# EAGLE design Adafruit ISO1540 (EAGLE 9.6.2)
AUTHOR: BRYAN; COMPANY: ADAFRUIT INDUSTRIES; REV: A
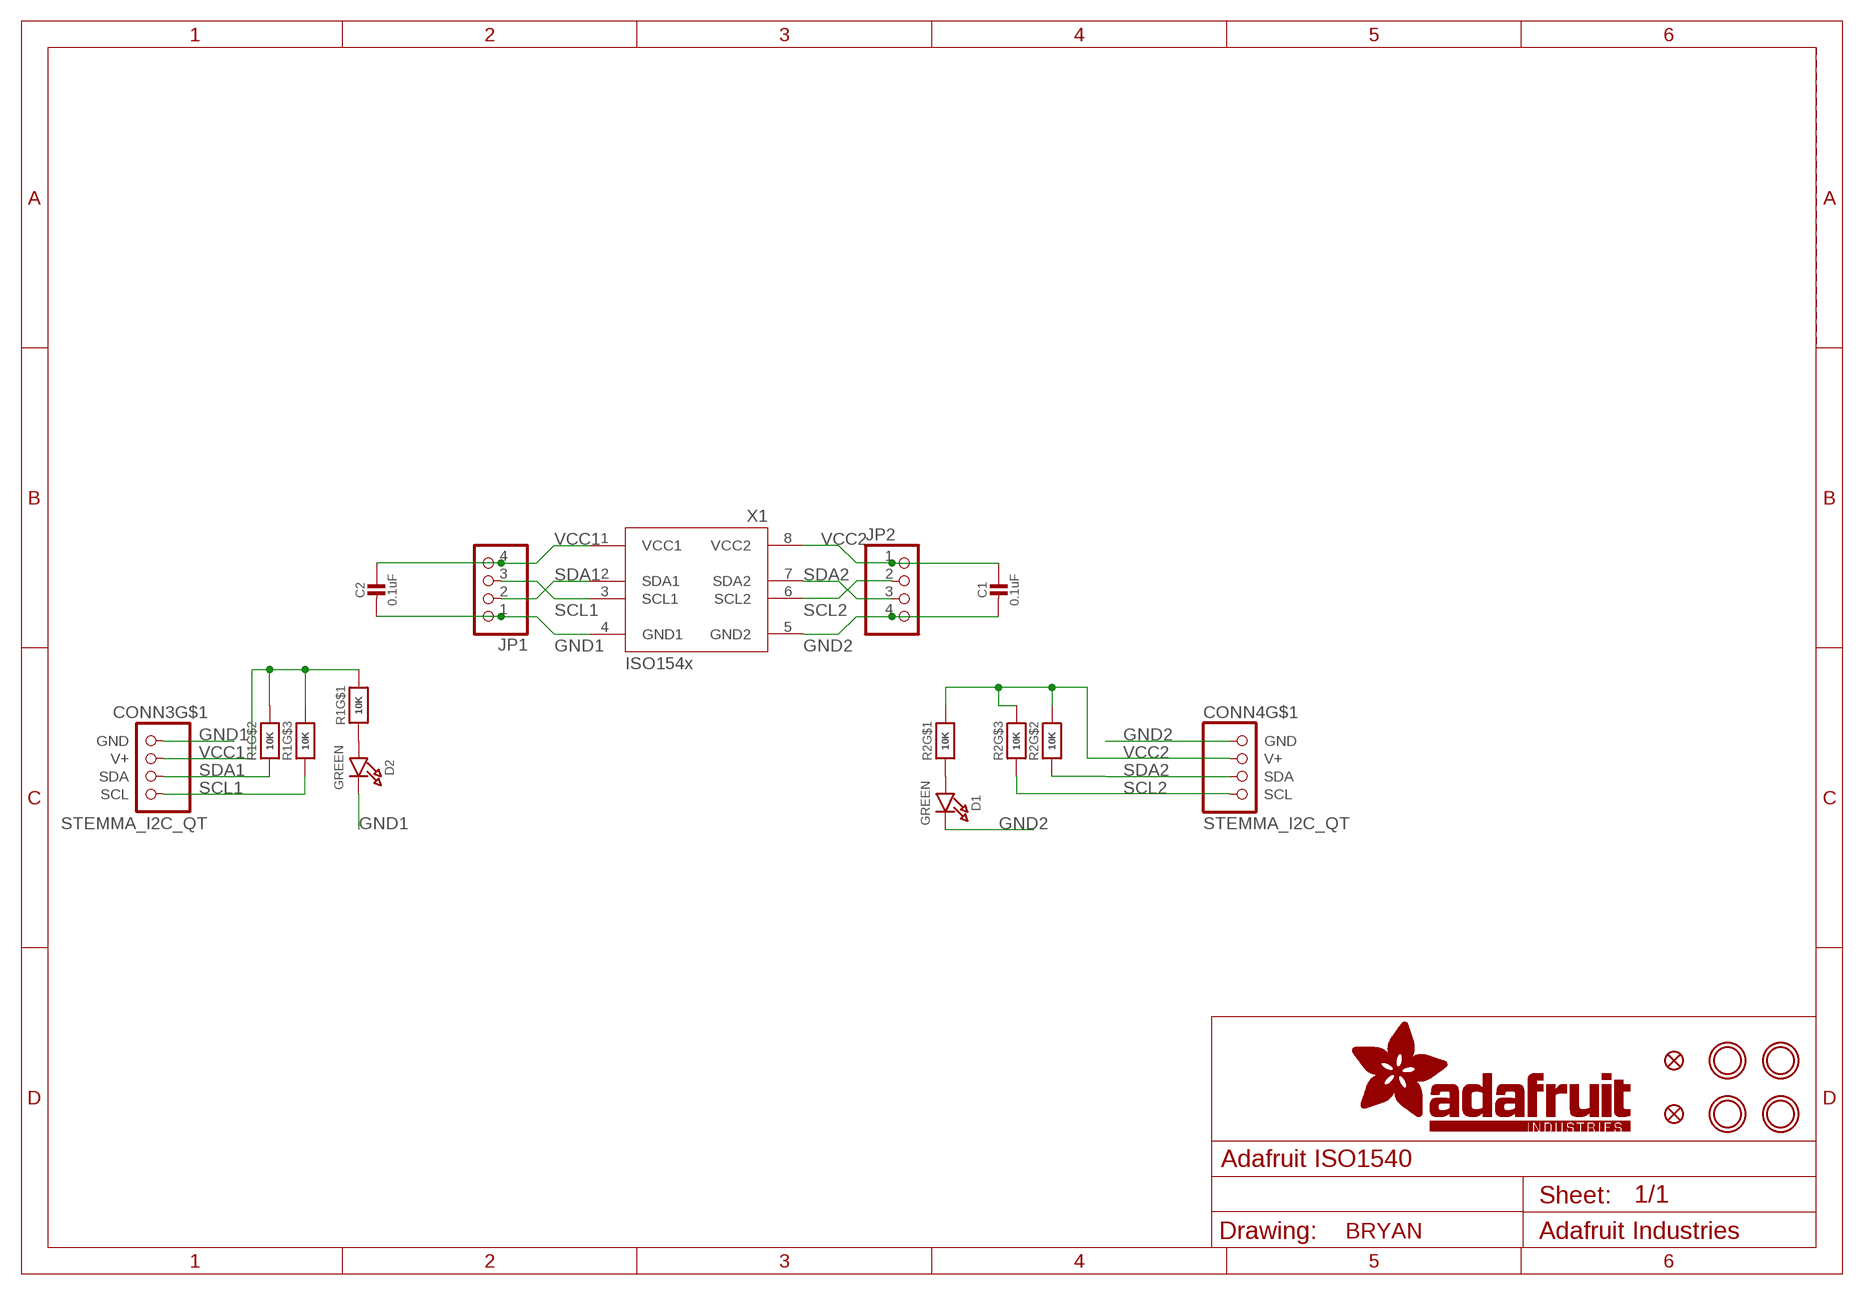
[diagram p0: schematic, sheet 1]

## Parts
C1  0.1uF  CAP_CERAMIC0603_NO  [0603-NO]
C2  0.1uF  CAP_CERAMIC0603_NO  [0603-NO]
CONN3  STEMMA_I2C_QT  [JST_SH4]
CONN4  STEMMA_I2C_QT  [JST_SH4]
D1  GREEN  LED0603_NOOUTLINE  [CHIPLED_0603_NOOUTLINE]
D2  GREEN  LED0603_NOOUTLINE  [CHIPLED_0603_NOOUTLINE]
FID3  FIDUCIAL_1MM  [FIDUCIAL_1MM]
FID4  FIDUCIAL_1MM  [FIDUCIAL_1MM]
JP1  HEADER-1X4ROUND  [1X04_ROUND]
JP2  HEADER-1X4ROUND  [1X04_ROUND]
R1  10K  RESISTOR_4PACK  [RESPACK_4X0603]
R2  10K  RESISTOR_4PACK  [RESPACK_4X0603]
U$1  MOUNTINGHOLE2.5  [MOUNTINGHOLE_2.5_PLATED]
U$17  MOUNTINGHOLE2.5  [MOUNTINGHOLE_2.5_PLATED]
U$19  MOUNTINGHOLE2.5  [MOUNTINGHOLE_2.5_PLATED]
U$21  MOUNTINGHOLE2.5  [MOUNTINGHOLE_2.5_PLATED]
X1  ISO154X  [SOIC8_150MIL]

## Nets
GND1: C2.2 CONN3.1(GND) D2.C JP1.1 X1.4(GND1)
GND2: C1.2 CONN4.1(GND) D1.C JP2.4 X1.5(GND2)
N$1: D2.A R1.1
N$2: D1.A R2.1
SCL1: CONN3.4(SCL) JP1.3 R1.3 X1.3(SCL1)
SCL2: CONN4.4(SCL) JP2.2 R2.3 X1.6(SCL2)
SDA1: CONN3.3(SDA) JP1.2 R1.2 X1.2(SDA1)
SDA2: CONN4.3(SDA) JP2.3 R2.2 X1.7(SDA2)
VCC1: C2.1 CONN3.2(V+) JP1.4 R1.6 R1.7 R1.8 X1.1(VCC1)
VCC2: C1.1 CONN4.2(V+) JP2.1 R2.6 R2.7 R2.8 X1.8(VCC2)
Unconnected: CONN3.MT1(MT) CONN3.MT2(MT) CONN4.MT1(MT) CONN4.MT2(MT) R1.4 R1.5 R2.4 R2.5

## Library data of the parts
C1 C2 = microbuilder:CAP_CERAMIC: Ceramic Capacitors For new designs, use the packages preceded by an '_' character since they are more reliable: The following footprints should be used on most boards: _0402 - Standard footprint for regular board layouts _0603 - Standard footprint for regular board layouts _0805 - Standard footprint for regular board layouts _1206 - Standard footprint for regular board layouts For extremely tight-pitch boards where space is at a premium, the following 'micro-pitch' footprints can be used (smaller pads, no silkscreen outline, etc.): _0402MP - Micro-pitch footprint for very dense/compact boards _0603MP - Micro-pitch footprint for very dense/compact boards _0805MP - Micro-pitch footprint for very dense/compact boards _1206MP - Micro-pitch footprint for very dense/compact boards
CONN3 CONN4 = microbuilder:STEMMA_I2C
D1 D2 = microbuilder:LED: LED 0603 - 0603 Surface Mount Package 2mA: Green LED - Low Power (3.9mcd, 2ma, 1.7Vf) - Digikey: 475-2709-2-ND Orange LED - Low Power (9.8mcd, 2ma, 1.8Vf) - Digikey: 475-1194-2-ND Red LED - Low Power (5mcd, 2ma, 1.8Vf) - Digikey: 475-1195-2-ND Yellow LED - Low Power (7mcd, 2ma, 1.8Vf) - Digikey: 475-1196-2-ND 5mA: Blue LED - Low Power (17mcd, 5ma, 2.9Vf) - Digikey: LNJ937W8CRACT-ND 0805 - 0805 Surface Mount Package 2mA: Red LED (8.8mcd, 2mA, 1.8Vf, Clear) - Low Power [Digikey: 475-2510-1-ND] Green LED (5mcd, 2mA, 1.8Vf, Clear) - Low Power [Digikey: 475-2730-1-ND] Yellow LED (11.3mcd, 2mA, 1.8Vf, Clear) - Low Power [Digikey: 475-2555-1-ND] 20mA: Red LED (104mcd, 20mA, Diffused) - LS R976 [Digikey: 475-1278-6-ND] Red LED (12mcd, 20mA, 2.0Vf, Clear) - APT2012EC [Digikey: 754-1128-1-ND] Green LED (15mcd, 20mA, 2.2Vf, Clear) - APT2012GC [Digikey: 754-1131-1-ND] Orange LED (160mcd, 20mA, 2.1Vf, Clear) - APT2012SECK [Digikey: 754-1130-1-ND] 1206 - 1206 Surface Mount Package Green LED (26mcd, 20mA, Diffused) - LG N971 [Digikey: 475-1407-6-ND] Red LED (15mcd, 20mA, Diffused) - LH N974 [Digikey: 475-1416-6-ND] Cree - Cree High-Power Surface Mount LEDs XPEBWT-L1-0000-00D50 - White 111lm 350mA 2.9Vf 6200K 110° XTEAWT-00-0000-00000LEE3 - White 114lm 350mA 2.85Vf 5000K 115° Everlight - Everlight 45-21 Series Surface Mount LEDs 45-21/QK2C-B2832AC2CB2/2T - Warm White 2000mcd 20mA 3.25Vf 3050K 120° 45-21/LK2C-B38452C4CB2/2T - Nuetral White 2000mcd 20mA 3.25Vf 4150K 120° 45-21/LK2C-B50634C6CB2/2T - Cold White 2200mcd 20mA 3.25Vf 5650K 120° PLCC2 Reverse Mount LS T77K-J1L2-1-0-2-R18-Z - Red 11.25mcd 2mA 1.8Vf 630nm 120° LO T77K-L1M2-24-Z - Orange 19.6mcd 2mA 1.8Vf 606nm 120° LY T77K-K2M1-26-Z - Yellow 15.7mcd 2mA 1.8Vf 587nm 120°
FID3 FID4 = microbuilder:FIDUCIAL: Fiducial Alignment Points Various fiducial points for machine vision alignment.; BOM: EXCLUDE
JP1 JP2 = microbuilder:HEADER-1X4: PIN HEADER
R1 R2 = microbuilder:RESISTOR_4PACK: Resistor Packs (4 resistors) 4 x 0603 10K 1/16W - Digikey: YC164J-10KCT-ND
U$1 U$17 U$19 U$21 = microbuilder:MOUNTINGHOLE: Mounting Hole For #2 screws (0.086"/2.18mm width, 0.094"/2.4mm hole) use 2.5mm; BOM: EXCLUDE
X1 = adafruit_power:ISO154X

## Net classes
1 highpower: width 0.406 mm, drill 0.483 mm
2 lowpower: width 0.305 mm, drill 0.483 mm

## Board
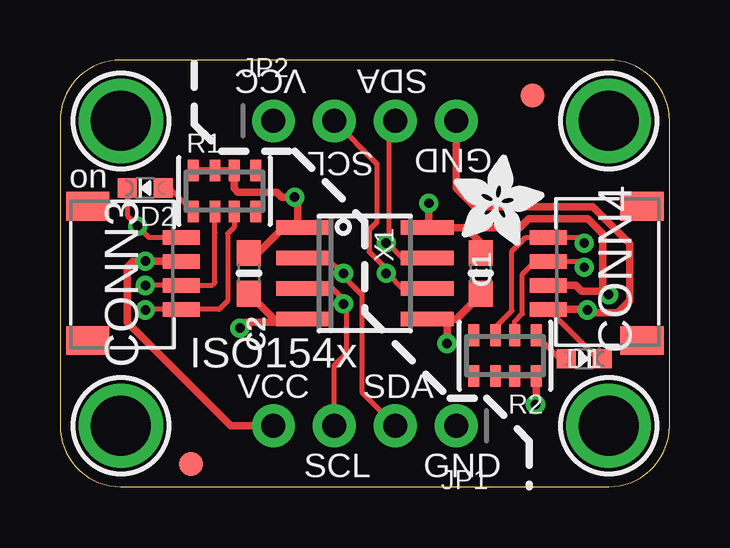
[diagram p1: board, top side]
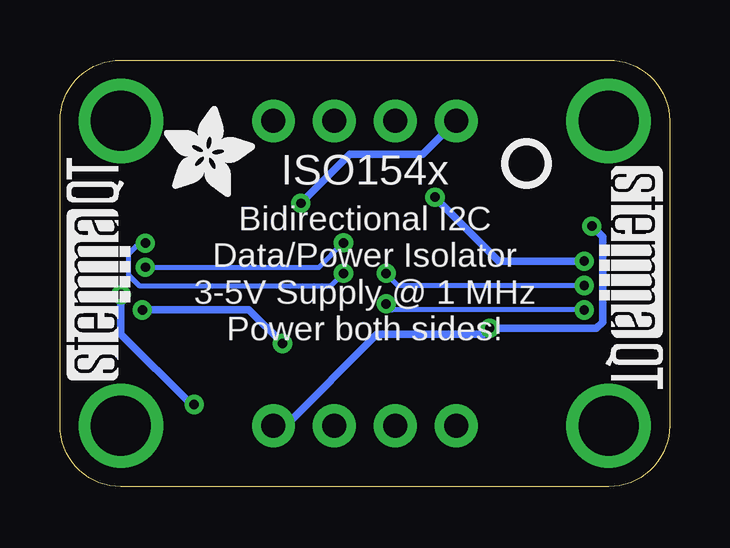
[diagram p2: board, bottom side, seen from below]

Size 25.4 x 17.78 mm. Coordinates in mm from the lower left corner, seen from the top.
Outline: 0,15.24 0,2.54 arc90 2.54,0 22.86,0 arc90 25.4,2.54 25.4,15.24 arc90 22.86,17.78 2.54,17.78 arc90 0,15.24
Copper layers (1*16): Top 0.035mm / dielectric 1.5mm / Bottom 0.035mm
Design rules "adafruit *": minimum track width 8mil, minimum drill 15.5mil, track to track 8mil, track to pad 8mil, pad to pad 8mil, via to via 8mil, smd to smd 8mil, copper to edge 10mil, drill to drill 8mil, minimum pad ring 10mil, minimum via ring 8mil, stop-mask expansion 2mil, vias tented up to drill 20mil, thermal gap 10mil

### Footprints (pad centres in the part's own frame; a part is rotated, then mirrored left to right if it is on the bottom)
0603-NO = smd 1.075 x 1: 1 -0.85,0; 2 0.85,0
JST_SH4 = smd 0.6 x 1.55: 1 -1.5,2.514; 2 -0.5,2.514; 3 0.5,2.514; 4 1.5,2.514 | smd 1.2 x 1.8: MT1 -2.8,-1.386; MT2 2.8,-1.386
CHIPLED_0603_NOOUTLINE = smd 0.8 x 0.8: A 0,-0.75; C 0,0.75
FIDUCIAL_1MM = smd 1 x 1: 1 0,0
1X04_ROUND = drill 1 pad 1.778: 1 -3.81,0; 2 -1.27,0; 3 1.27,0; 4 3.81,0
RESPACK_4X0603 = smd 0.45 x 0.9: 1 -1.3,-0.85; 2 -0.4,-0.85; 3 0.4,-0.85; 4 1.3,-0.85; 5 1.3,0.85; 6 0.4,0.85; 7 -0.4,0.85; 8 -1.3,0.85
MOUNTINGHOLE_2.5_PLATED = drill 2.5 pad 3.2: P$1 0,0
SOIC8_150MIL = smd 0.6 x 2.2: 1 -1.905,-2.6; 2 -0.635,-2.6; 3 0.635,-2.6; 4 1.905,-2.6; 5 1.905,2.6; 6 0.635,2.6; 7 -0.635,2.6; 8 -1.905,2.6

### Placement (x,y rotation side)
C1  17.53,8.89 270 top
C2  7.87,8.89 270 top
CONN3  2.54,8.89 270 top
CONN4  22.86,8.89 90 top
D1  21.84,5.33 270 top
D2  3.56,12.45 90 top
FID3  5.46,0.95 0 top
FID4  19.68,16.29 0 top
JP1  12.7,2.54 180 top
JP2  12.7,15.24 0 top
R1  6.86,12.32 0 top
R2  18.54,5.46 180 top
U$1  2.54,15.24 0 top
U$2  [ADAFRUIT_3.5MM]  21.08,12.06 0 bottom
U$17  22.86,15.24 0 top
U$19  2.54,2.54 0 top
U$21  22.86,2.54 0 top
U$22  [ADAFRUIT_3.5MM]  16.38,10.03 0 top
U$25  [PCBFEAT-REV-040]  5.97,13.46 0 bottom
U$30  [STEMMAQT]  22.48,4.45 90 bottom
U$31  [STEMMAQT]  2.92,13.34 270 bottom
X1  12.7,8.89 270 top

### Tracks (layer width: path | path; a pad name or v marks a point on that pad's centre or on a via)
GND1  (via drill 0.39)
  Top 0.203: D2.C 2.81,11.29 v3.24,10.86 3.71,10.39 CONN3.1
  Top 0.305: C2.2 8.93,6.99 | 8.93,6.99 9.06,6.86 7.75,6.86 v7.49,6.6 | 8.93,6.99 X1.4
  Bottom 0.305: JP1.1 16,2.54 12.19,6.35 7.75,6.35 v7.49,6.6 3.05,6.6 2.79,6.86 2.79,10.41 v3.24,10.86
GND2  (via drill 0.39)
  Top 0.203: CONN4.1 22.4,5.33 D1.C
  Top 0.305: X1.5 16.26,6.99 | 16.26,6.99 16.51,6.99 17.53,8 C1.2 | CONN4.1 21.95,7.39 v21.97,7.37 22.1,7.24 23.24,7.24 23.75,7.75 23.75,10.12 22.2,11.66 17.29,11.66 16.51,12.45 JP2.4 | v16.13,5.97 16.13,6.86 16.26,6.99
  Bottom 0.305: v21.97,7.37 17.53,7.37 v16.13,5.97
N$1
  Top 0.203: D2.A 4.58,12.45 R1.1
N$2
  Top 0.203: R2.1 20.82,5.33 D1.A
SCL1  (via drill 0.39)
  Top 0.203: R1.3 7.26,10.81 6.99,10.54 6.99,7.75 6.63,7.39 CONN3.4 3.58,7.39 v3.56,7.37 | X1.3 11.37,8.26 11.81,7.81 v11.81,7.62 11.94,7.49 11.94,5.59 11.43,5.08 JP1.3
  Bottom 0.203: v3.56,7.37 11.56,7.37 v11.81,7.62
SCL2  (via drill 0.39)
  Top 0.203: v21.84,10.15 21.6,10.39 CONN4.4 19.41,10.39 18.83,9.81 18.83,7.34 18.14,6.65 R2.3 | X1.6 14.28,8.26 13.65,8.89 v13.59,8.89 13.59,9.08 12.88,9.79 12.88,10.71 13.21,11.03 13.21,13.46 JP2.2
  Bottom 0.203: v21.84,10.15 22.1,10.15 22.55,9.7 22.55,8.83 22.1,8.38 14.1,8.38 v13.59,8.89
SDA1  (via drill 0.39)
  Top 0.203: R1.2 6.46,10.59 6.45,10.58 6.45,8.51 6.33,8.39 CONN3.3 v3.56,8.39 v3.56,8.38 | X1.2 11.12,9.53 11.75,8.89 v11.81,8.89 11.81,8.76 12.57,8 12.57,3.94 JP1.2
  Bottom 0.203: v3.56,8.38 11.3,8.38 v11.81,8.89
SDA2  (via drill 0.39)
  Top 0.203: v21.84,9.14 21.6,9.39 CONN4.3 19.8,9.39 19.27,8.85 19.27,7.2 18.94,6.88 R2.2 | X1.7 14.28,9.53 13.65,10.16 v13.59,10.16 13.72,10.29 13.72,14.99 JP2.3
  Bottom 0.203: v21.84,9.14 14.61,9.14 v13.59,10.16
VCC1  (via drill 0.39)
  Top 0.305: C2.1 8.26,9.74 9.31,10.79 9.91,10.79 | 9.91,10.79 X1.1 | CONN3.2 v3.56,9.39 v3.56,9.4 3.05,9.4 2.79,9.14 2.79,6.86 7.11,2.54 JP1.4 | 9.91,10.79 9.91,11.94 v9.78,12.06 9.25,12.06 9.04,12.28 7.41,12.28 7.26,12.43 R1.6 R1.7 R1.8
  Bottom 0.305: v3.56,9.4 7.11,9.4 v9.78,12.06
VCC2  (via drill 0.39)
  Top 0.203: R2.8 R2.7 R2.6
  Top 0.305: X1.8 15.37,10.79 | 15.37,10.79 16.89,10.79 | C1.1 17.53,10.16 16.89,10.79 | v15.37,11.81 15.37,10.79 | R2.8 19.84,3.46 v19.81,3.43 | CONN4.2 21.49,8.39 21.74,8.14 22.73,8.14 v22.86,8 22.61,8.26 22.61,10.54 21.99,11.16 19.53,11.16 19.16,10.79 16.89,10.79
  Bottom 0.305: JP2.1 10.29,13.84 13.34,13.84 v15.37,11.81 | v19.81,3.43 19.94,3.43 22.86,6.35 v22.86,8

### Text on the board
tPlace: VCC | SDA | GND | SCL | on | ISO154x | VCC | SDA | SCL | GND
bPlace: ISO154x | Bidirectional I2C / Data/Power Isolator / 3-5V Supply @ 1 MHz / Power both sides!